# Altium project PCB_Project.PrjPcb (part 1 of 2)
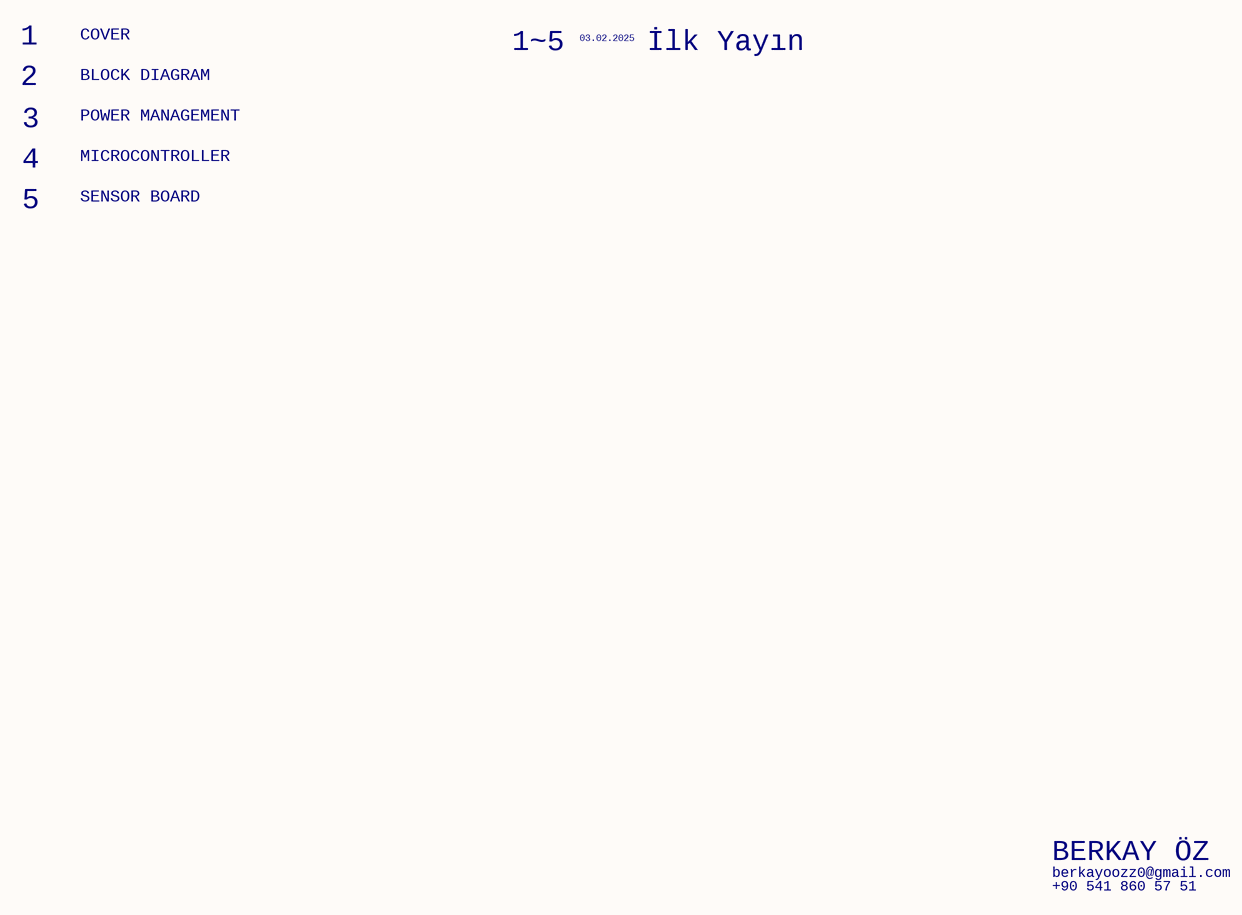
[diagram p0: Cover.SchDoc]
4 sheets, 85 parts. Net scope: flat (ports and power ports of the same name join across sheets).
Board files: PCB1.PcbDoc, PCB2_panel.PcbDoc
Sheets:
  Cover.SchDoc
  Block Diagram.SchDoc
  Microcontroller.SchDoc
  Sensorboard.SchDoc

## Sheet Cover.SchDoc
size A3; DocumentNumber: 1; SheetNumber: 1; SheetTotal: 5; PreparedBy: berkay; ReleaseDate: 23.11.2024; ENG_APP_DATE: --/--/--; DSN_APP_DATE: --/--/--; CHK_APP_DATE: --/--/--; ProjectUnit: mm

### Notes on the sheet
- 1
- COVER
- 1~5
- 03.02.2025
- İlk Yayın
- 2
- BLOCK DIAGRAM
- POWER MANAGEMENT
- 3
- 4
- MICROCONTROLLER
- 5
- SENSOR BOARD
- BERKAY ÖZ
- berkayoozz0@gmail.com
- +90 541 860 57 51
- Sayfa Nu.
- İÇİNDEKİLER / CONTENTS
- Tarih
- REVİZYON / REVISION
- ÜRETİM NOTLARI / PRODUCTION NOTES
- Page No
- Açıklama / Description
- Date
- Özellikleri
- Kart
- Features
- Board
- /
- Çıktıları
- Üretim
- Gerber
- Files
- Ekler
- Attachments
- İLETİŞİM / CONTACT
- File Name:
- Prepared:
- Size:
- Description:
- Unit:
- A3
- Released:
- Edited:
- Revision:
- Checked:
- Department:
- Approved:
- Sheet:

## Sheet Block Diagram.SchDoc
size A3; CheckedBy: deneme; DocumentNumber: 2; SheetNumber: 2; SheetTotal: 5; ProjectDescription: Wireless Security Detector; ProjectUnit: mm
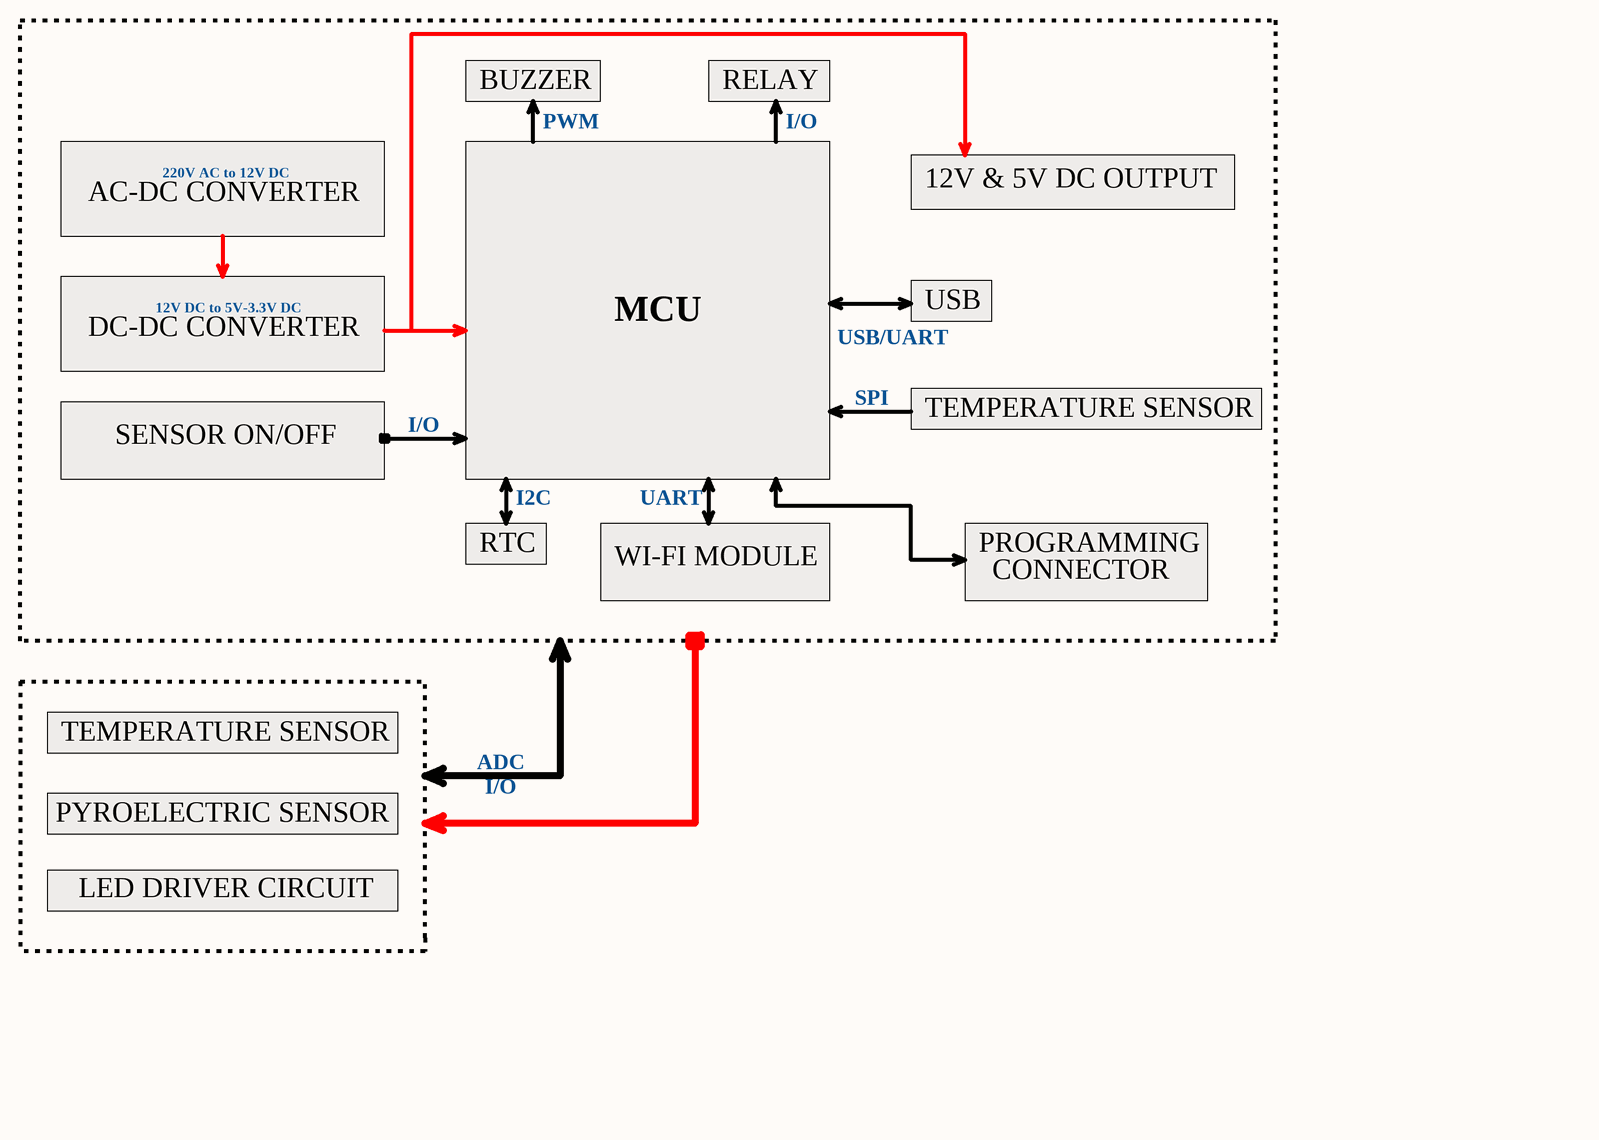
[diagram p1: Block Diagram.SchDoc]

### Notes on the sheet
- BUZZER
- PWM
- RELAY
- I/O
- AC-DC CONVERTER
- 220V AC to 12V DC
- 12V & 5V DC OUTPUT
- DC-DC CONVERTER
- 12V DC to 5V-3.3V DC
- MCU
- USB/UART
- USB
- SPI
- TEMPERATURE SENSOR
- SENSOR ON/OFF
- RTC
- I2C
- UART
- PROGRAMMING
- WI-FI MODULE
- CONNECTOR
- FUSE: 3413.0216.22
  BUCK CAPACITOR: ESH477M050AH4AA
  ZERO OHM RESISTOR: RC0603JR-070RL
  CERAMIC CAPACITORS:
  CL21A475KAQNNNE
  CL21B104KBCNNNC
  0603B103K160CT
  ALUMINUM CAPACITOR:
  EEV686M035A9HAA
  ZENER DIODE: 1SMB5919BT3G
  12V,5V DC CONNECTOR: PJ-037AH-SMT-TR
  TERMINAL BLOCK: TBP01R1-508-02BE
  PROGRAMMING CONNECTOR: SMH-105-02-L-S
  DIODE FOR RELAY: 1N4148WS
  TRANSISTOR FOR RELAY (NPN): MMBT3904-7-F
  MICRO B USB CONNECTOR:
  10118192-0001LF
  CONNECTOR: 64800611622
  CRYSTALS:
  ABS05-32.768KHZ-T
  ECS-160-20-30B-TR
  LOAD CAP FOR CRYSTALS:
  CL10C200JB8NNNC
  USB PROTECTION (TVS): USBLC6-2SC6
  IC FOR PIR SENSOR: NCS36000DRG
  RESISTORS FOR IC PIR:
  RC0603JR-07560RL
  RC0603JR-07220KL
  RC0603FR-0743KL
  CAPACITORS FOR IC PIR:
  C3216X5R1E336M160AC
  RED LED (FOR SECURITY CAM LOOK): 150080RS75000
  GREEN LED: 150080GS75000
  OPAMP: OPA314AIDBVR
- PYROELECTRIC SENSOR
- ADC
- LED DRIVER CIRCUIT
- HABERLEŞME PROTOKOLLERİ:
  UART
  USART
  I2C
  SPI
- KOMPONENTLER:
  RTC: M41T00M6F
  WIFI MODULE: ESP32-WROOM-32E-N4
  PYROSENSOR: LHI 878/3902
  TEMPERATURE OUTSIDE: TFPT1206L1002FM
  TEMPERATURE INSIDE: MAX6662MSA+
  MCU: STM32F103C6T6A
  RELAY: ALQ112
  BUZZER: CMI-9605IC-0580T
  SENSOR ON/OFF: EG1215AA
  AC-DC CONVERTER:
  TRAFO: BV302S12010-ZU
  RECTIFIER: DB105STR
  DC-DC CONVERTER:
  5V DC: LM2675MX-12/NOPB
  3.3V DC: AP7361-33E-13
  LED DRIVER MOSFET:SSM3K376R,LF
- RESISTORS:
  RC0603FR-0710KL
  RC0603JR-0715RL
  CAPACITORS:
  C0603C104K4RACTU
  ALA7DA471CF450
  PCR1E471MCL1GS
- File Name:
- Prepared:
- Size:
- Description:
- Unit:
- A3
- Released:
- Edited:
- Revision:
- Checked:
- Department:
- Approved:
- Sheet:

## Sheet Microcontroller.SchDoc
size A3; ApprovedBy: Berk AYDOĞAN; CheckedBy: KTU; DocumentNumber: 4; Revision: AA; SheetNumber: 4; SheetTotal: 5; PreparedBy: Berkay ÖZ; ProjectDescription: Wireless Security Detector; ProjectUnit: mm; ReleaseDate: 13.02.2025; Department: Department
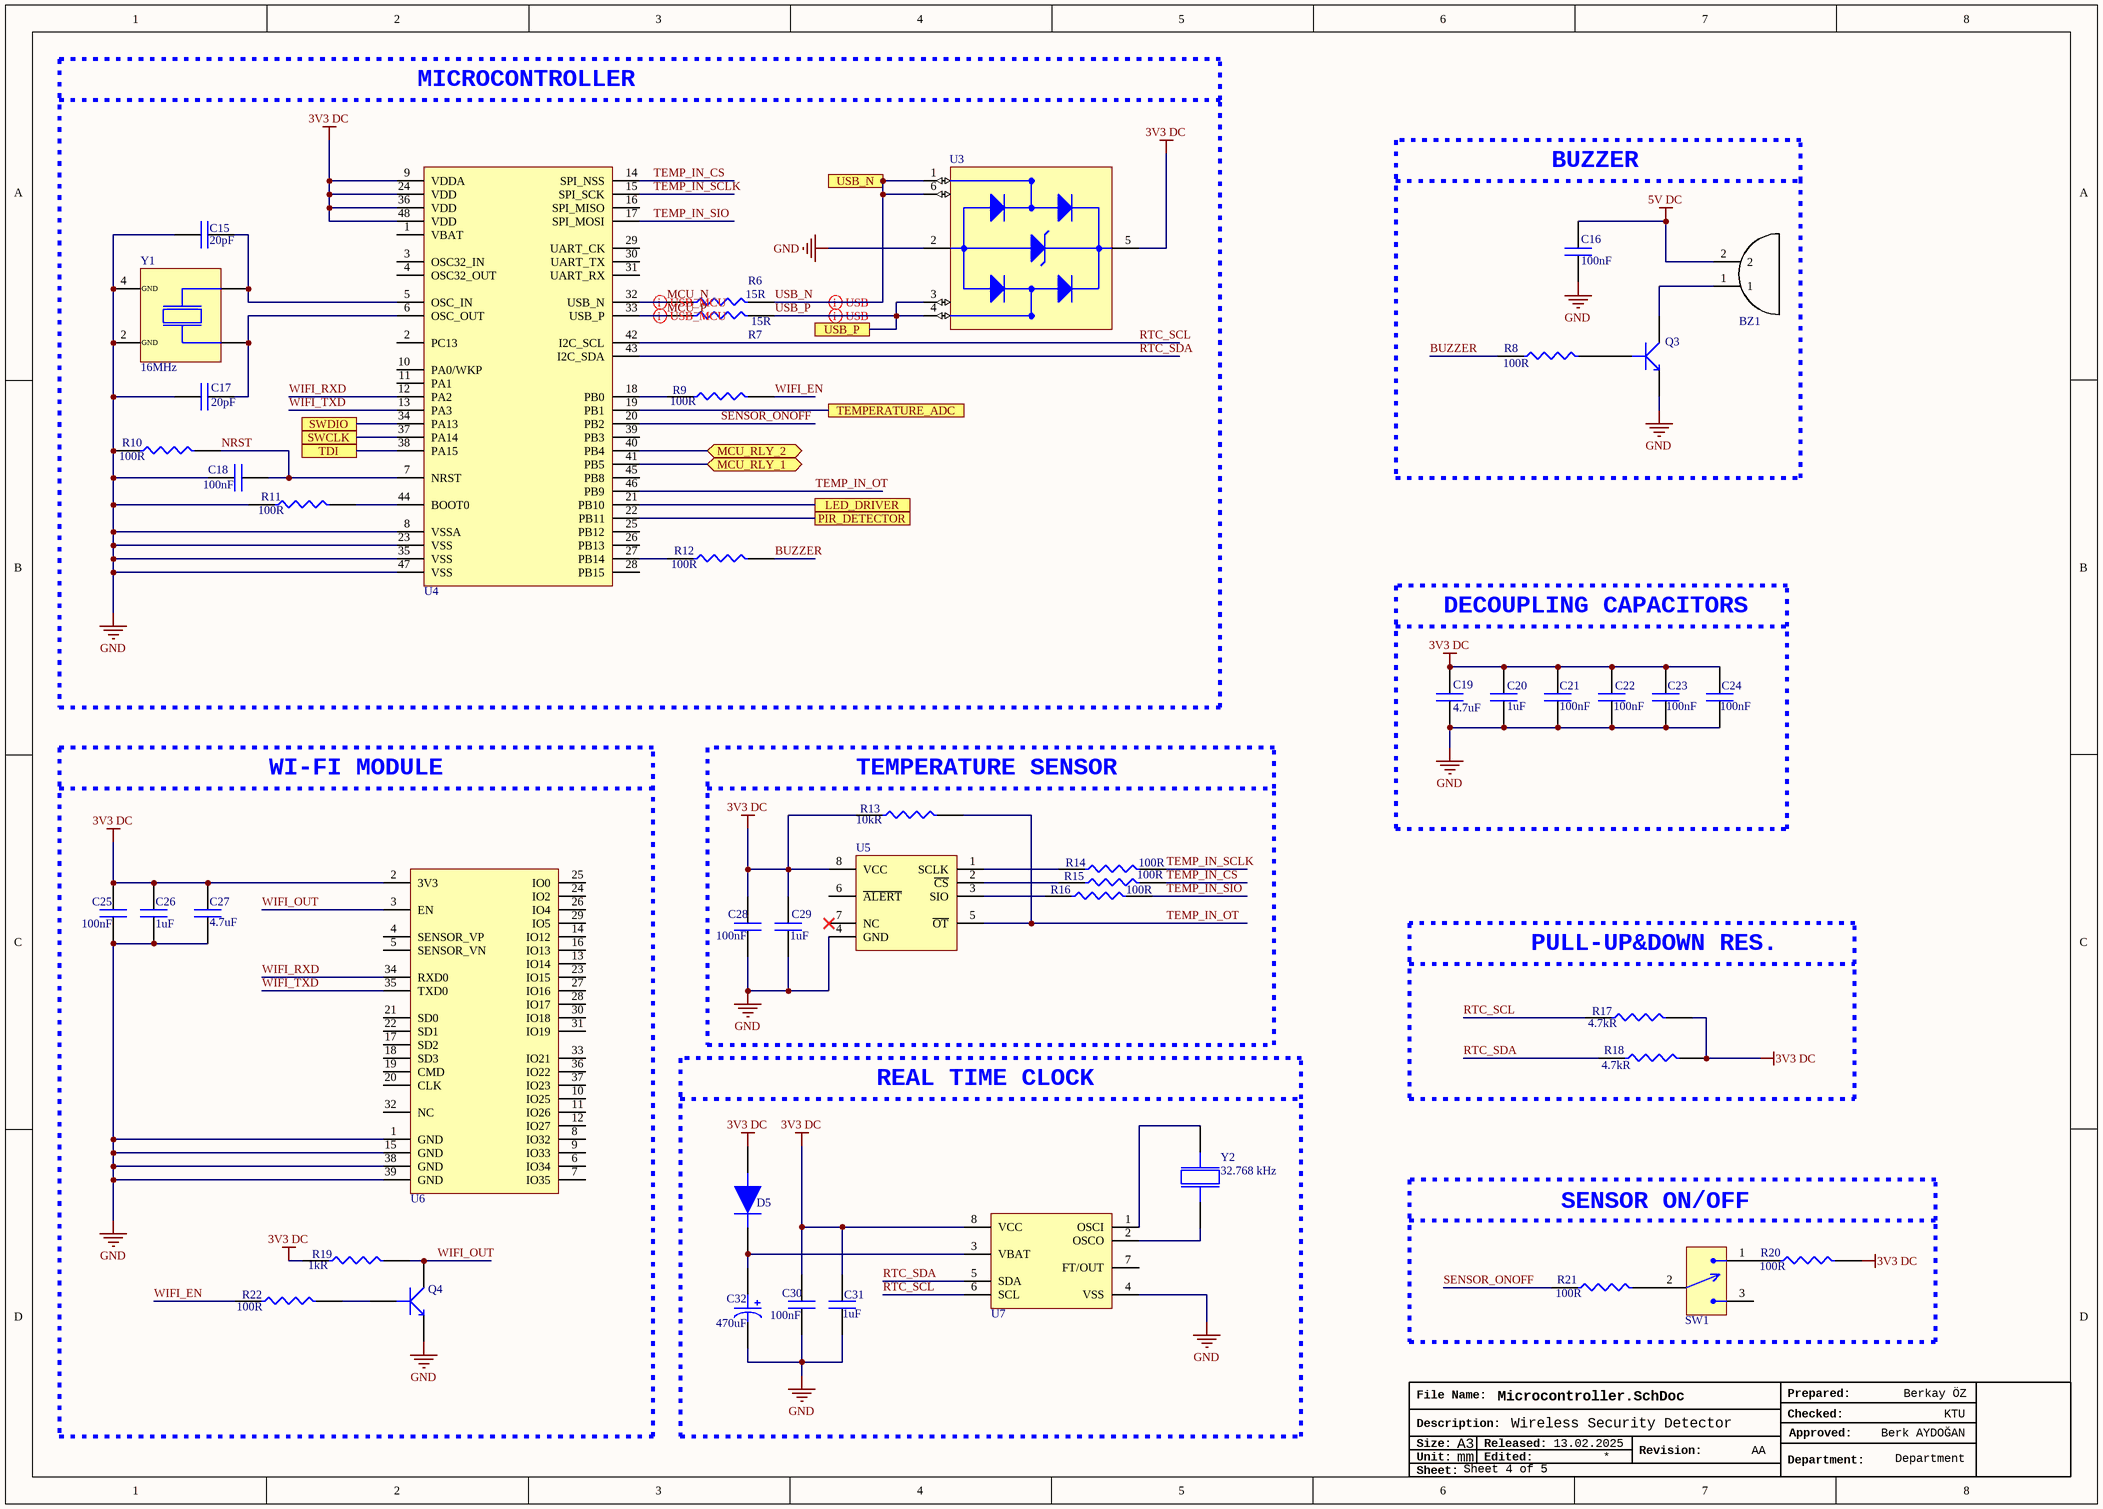
[diagram p2: Microcontroller.SchDoc]

### Parts
BZ1  CMI-9605IC-0580T  [CMI-9605IC]  (value not drawn)
C15  Capacitance: 20pF  [CAP_0603]  (hidden comment: CL10C200JB8NNNC)
C16  Capacitance: 100nF  [CAP_0805]  (hidden comment: CL21B104KBCNNNC)
C17  Capacitance: 20pF  [CAP_0603]  (hidden comment: CL10C200JB8NNNC)
C18  Capacitance: 100nF  [CAP_0805]  (hidden comment: CL21B104KBCNNNC)
C19  Capacitance: 4.7uF  [CAP_0805]  (hidden comment: CL21A475KAQNNNE)
C20  Capacitance: 1uF  [CAP_0805]  (hidden comment: CL21B105KBFNNNE)
C21  Capacitance: 100nF  [CAP_0805]  (hidden comment: CL21B104KBCNNNC)
C22  Capacitance: 100nF  [CAP_0805]  (hidden comment: CL21B104KBCNNNC)
C23  Capacitance: 100nF  [CAP_0805]  (hidden comment: CL21B104KBCNNNC)
C24  Capacitance: 100nF  [CAP_0805]  (hidden comment: CL21B104KBCNNNC)
C25  Capacitance: 100nF  [CAP_0603]  (hidden comment: C0603C104K4RACTU)
C26  Capacitance: 1uF  [CAP_0805]  (hidden comment: CL21B105KBFNNNE)
C27  Capacitance: 4.7uF  [CAP_0805]  (hidden comment: CL21A475KAQNNNE)
C28  Capacitance: 100nF  [CAP_0603]  (hidden comment: C0603C104K4RACTU)
C29  Capacitance: 1uF  [CAP_0805]  (hidden comment: CL21B105KBFNNNE)
C30  Capacitance: 100nF  [CAP_0805]  (hidden comment: CL21B104KBCNNNC)
C31  Capacitance: 1uF  [CAP_0805]  (hidden comment: CL21B105KBFNNNE)
C32  Capacitance: 470uF  [CAP_RADIAL_D10_P5]  (hidden comment: ESH477M050AH4AA)
D5  1N4148WS  [SOD323F]  (value not drawn)
Q3  MMBT3904-7-F  [SOT23F]  (value not drawn)
Q4  MMBT3904-7-F  [SOT23F]  (value not drawn)
R6  Resistance: 15R  [RES_0603]  (hidden comment: RC0603JR-0715RL)
R7  Resistance: 15R  [RES_0603]  (hidden comment: RC0603JR-0715RL)
R8  Resistance: 100R  [RES_0603]  (hidden comment: RC0603FR-07100RL)
R9  Resistance: 100R  [RES_0603]  (hidden comment: RC0603FR-07100RL)
R10  Resistance: 100R  [RES_0603]  (hidden comment: RC0603FR-07100RL)
R11  Resistance: 100R  [RES_0603]  (hidden comment: RC0603FR-07100RL)
R12  Resistance: 100R  [RES_0603]  (hidden comment: RC0603FR-07100RL)
R13  Resistance: 10kR  [RES_0603]  (hidden comment: RC0603FR-0710KL)
R14  Resistance: 100R  [RES_0603]  (hidden comment: RC0603FR-07100RL)
R15  Resistance: 100R  [RES_0603]  (hidden comment: RC0603FR-07100RL)
R16  Resistance: 100R  [RES_0603]  (hidden comment: RC0603FR-07100RL)
R17  Resistance: 4.7kR  [RES_0603]  (hidden comment: RC0603FR-074K7L)
R18  Resistance: 4.7kR  [RES_0603]  (hidden comment: RC0603FR-074K7L)
R19  Resistance: 1kR  [RES_0603]  (hidden comment: RC0603FR-071KL)
R20  Resistance: 100R  [RES_0603]  (hidden comment: RC0603FR-07100RL)
R21  Resistance: 100R  [RES_0603]  (hidden comment: RC0603FR-07100RL)
R22  Resistance: 100R  [RES_0603]  (hidden comment: RC0603FR-07100RL)
SW1  EG1215AA  [EG1215AA]  (value not drawn)
U3  USBLC6-2SC6  [SOT23-6L]  (value not drawn)
U4  STM32F103C6T6A  [LQFP-48]  (value not drawn)
U5  MAX6662  [SOIC 8]  (value not drawn)
U6  ESP32-WROOM-32  [ESP32-32]  (value not drawn)
U7  M41T00SM6F  [SOIC 8]  (value not drawn)
Y1  Frequency: 16MHz  [ECS]  (hidden comment: ECS-160-20-30B-TR)
Y2  Operating Frequency: 32.768 kHz  [ABS05]  (hidden comment: ABS05-32.768KHZ-T)

### Blocks framed on the sheet
MICROCONTROLLER: C15 C17 C18 R6 R7 R9-R12 U3 U4 Y1
WI-FI MODULE: C25-C27 Q4 R19 R22 U6

### Ports
LED_DRIVER, MCU_RLY_1 (bidir), MCU_RLY_2 (bidir), PIR_DETECTOR, SWCLK, SWDIO, TDI, TEMPERATURE_ADC, USB_N, USB_P

### Nets
3V3 DC: C19.2 C20.2 C21.2 C22.2 C23.2 C24.2 C25.2 C26.2 C27.2 C28.2 C29.2 C30.2 C31.2 D5.A R13.1 R17.2 R18.2 R19.1 R20.2 U3.5(VBUS) U4.9(VDDA) U4.24(VDD) U4.36(VDD) U4.48(VDD) U5.8(VCC) U6.2(3V3) U7.8(VCC)
5V DC: BZ1.2 C16.2
GND: C15.1 C16.1 C17.1 C18.2 C19.1 C20.1 C21.1 C22.1 C23.1 C24.1 C25.1 C26.1 C27.1 C28.1 C29.1 C30.1 C31.1 C32.2 Q3.2(E) Q4.2(E) R10.1 R11.1 U3.2(GND) U4.8(VSSA) U4.23(VSS) U4.35(VSS) U4.47(VSS) U5.4(GND) U6.1(GND) U6.15(GND) U6.38(GND) U6.39(GND) U7.4(VSS) Y1.2(GND) Y1.4(GND)
BUZZER: R8.1 R12.2
MCU_N: R6.1 U4.32(USB_N)
MCU_P: R7.1 U4.33(USB_P)
NRST: C18.1 R10.2 U4.7(NRST)
RTC_SCL: R17.1 U4.42(I2C_SCL) U7.6(SCL)
RTC_SDA: R18.1 U4.43(I2C_SDA) U7.5(SDA)
SENSOR_ONOFF: R21.1 U4.20(PB2)
TEMP_IN_CS: R15.2 U4.14(SPI_NSS)
TEMP_IN_OT: R13.2 U4.46(PB9) U5.5(~{OT})
TEMP_IN_SCLK: R14.2 U4.15(SPI_SCK)
TEMP_IN_SIO: R16.2 U4.17(SPI_MOSI)
USB_N: R6.2 U3.1(I/O1_IN) U3.6(I/O1_OUT) ; port USB_N
USB_P: R7.2 U3.3(I/O2_IN) U3.4(I/O2_OUT) ; port USB_P
WIFI_EN: R9.2 R22.1
WIFI_OUT: Q4.3(C) R19.2 U6.3(EN)
WIFI_RXD: U4.12(PA2) U6.34(RXD0)
WIFI_TXD: U4.13(PA3) U6.35(TXD0)
NetBZ1_1: BZ1.1 Q3.3(C)
NetC15_2: C15.2 U4.5(OSC_IN) Y1.3
NetC17_2: C17.2 U4.6(OSC_OUT) Y1.1
NetC32_1: C32.1 D5.C U7.3(VBAT)
NetQ3_1: Q3.1(B) R8.2
NetQ4_1: Q4.1(B) R22.2
NetR9_1: R9.1 U4.18(PB0)
NetR11_2: R11.2 U4.44(BOOT0)
NetR12_1: R12.1 U4.27(PB14)
NetR14_1: R14.1 U5.1(SCLK)
NetR15_1: R15.1 U5.2(~{CS})
NetR16_1: R16.1 U5.3(SIO)
NetR20_1: R20.1 SW1.1
NetR21_2: R21.2 SW1.2
NetU4_19: U4.19(PB1) ; port TEMPERATURE_ADC
NetU4_21: U4.21(PB10) ; port LED_DRIVER
NetU4_22: U4.22(PB11) ; port PIR_DETECTOR
NetU4_34: U4.34(PA13) ; port SWDIO
NetU4_37: U4.37(PA14) ; port SWCLK
NetU4_38: U4.38(PA15) ; port TDI
NetU4_40: U4.40(PB4) ; port MCU_RLY_2
NetU4_41: U4.41(PB5) ; port MCU_RLY_1
NetU7_1: U7.1(OSCI) Y2.2
NetU7_2: U7.2(OSCO) Y2.1

Not connected (* = marked no-connect by the designer): SW1 3; U4 1(VBAT) 2(PC13) 3(OSC32_IN) 4(OSC32_OUT) 10(PA0/WKP) 11(PA1) 16(SPI_MISO) 25(PB12) 26(PB13) 28(PB15) 29(UART_CK) 30(UART_TX) 31(UART_RX) 39(PB3) 45(PB8); U5 6(~{ALERT}) 7(NC)*; U6 4(SENSOR_VP) 5(SENSOR_VN) 6(IO34) 7(IO35) 8(IO32) 9(IO33) 10(IO25) 11(IO26) 12(IO27) 13(IO14) 14(IO12) 16(IO13) 17(SD2) 18(SD3) 19(CMD) 20(CLK) 21(SD0) 22(SD1) 23(IO15) 24(IO2) 25(IO0) 26(IO4) 27(IO16) 28(IO17) 29(IO5) 30(IO18) 31(IO19) 32(NC) 33(IO21) 36(IO22) 37(IO23); U7 7(FT/OUT)

### Layout directives
differential pair: MCU_N, MCU_P, USB_N, USB_P

### Notes on the sheet
- BUZZER
- (near C16) DECOUPLING CAPACITOR
- DECOUPLING CAPACITORS
- (near R13) TEMPERATURE SENSOR
- Datasheet'de EN bağlantısını direnç ile yapmış fakat biz bunu transistörle yapıyoruz ki kullanmak istemediğimiz durumda direnç sökmek durumunda kalmayalım ve işimizi yazılımla halledebilelim.
- PULL-UP&DOWN RES.
- MCU'ya bağlarken birisinin RX'ini diğerinin TX'ine bağlıyoruz
- REAL TIME CLOCK
- (near U7) VBAT yerine kapasitör kullanıyoruz, 470uF seviyesindeki bir kapasitör 3.3V için neredeyse pil gibi davranır.
- SENSOR ON/OFF
- (near R21) Switch'i 1 konumuna aldığımızda işlemci pinlerine 3.3V gidecek, 3 konumuna aldığımızda 0V gidecek.
- (near Q4) BJT'nin base'ine WIFI_EN üzerinden logic 1 vermek isteriz, bu nedenle WIFI_EN bir çıkıştır.
- DECOUPLING CAPACITOR
- (near R20) Sensör On Off kısmından değeri okumak istiyoruz, röleyi kontrol etmek istemiyoruz bu nedenle input
- File Name:
- Prepared:
- Size:
- Description:
- Unit:
- A3
- Released:
- Edited:
- Revision:
- Checked:
- Department:
- Approved:
- Sheet:

### Library data of the parts
BZ1 = CMI-9605IC-0580T: Buzzers Indicator, Internally Driven Magnetic 5 V 30mA 2.7kHz 80dB @ 5V, 10cm Through Hole PC Pins; Manufacturer: CUI Devices; Shape: 4456Shape; Designed by: berkay; Supplier 1: Digikey; Manufacturer Part Number: CMI-9605IC-0580T; RoHS: No; Category: Buzzers; Stock 1: 3286; Pricing 1: 1=1,14, 10=0,932, 25=0,8584, 50=0,8072, 150=0,73213, 300=0,73127 (USD); Length: 9.6mm; Width: 9.6mm; Height: 5mm; Supplier Part Number 1: 2223-CMI-9605IC-0580T-ND; Case/Package: CMI-9605IC
C15 C17 = CAP CER 20pF 0603: Ceramic Capacitor, 20pF, 50 V, 5%, Pad SMD 0603 [1608 Metric]; Manufacturer: Samsung; Designed by: berkay; Voltage Rating (DC): 50V; Supplier 1: Digikey; Manufacturer Part Number: CL10C200JB8NNNC; RoHS: Yes; Category: Ceramic Capacitors; Stock 1: 238857; Pricing 1: 1=0,1, 10=0,029, 100=0,0173, 1000=0,01144 (USD); ComponentLink1URL: https://datasheet.ciiva.com/26877/getdatasheetpartid-640634-26877974.pdf?src-supplier=Verical; ComponentLink1Description: https://datasheet.ciiva.com/26877/getdatasheetpartid-640634-26877974.pdf?src-supplier=Verical; ComponentLink2URL: https://datasheet.ciiva.com/26310/mlcc-catalogdownload2013-eng-26310315.pdf?src-supplier=Distrelec; ComponentLink2Description: https://datasheet.ciiva.com/26310/mlcc-catalogdownload2013-eng-26310315.pdf?src-supplier=Distrelec; Supplier Part Number 1: 1276-1187-1-ND; Case/Package: 0603
C16 C18 C21-C24 C30 = CAP CER 100nF 0805: Ceramic Capacitor, 0.1 uF, 50 V, ï¿½ 10%, X7R, 0805 [2012 Metric]; Manufacturer: Samsung; Designed by: berkay; Voltage Rating: 50V; Supplier 1: Digikey; Manufacturer Part Number: CL21B104KBCNNNC; RoHS: Yes; Category: Ceramic Capacitors; Stock 1: 1199576; Pricing 1: 1=0,1, 10=0,029, 100=0,0175, 1000=0,01156 (USD); Mount: Surface Mount; Case/Package: 0805; Case Code (Metric): 2012; Case Code (Imperial): 0805; Material: Ceramic; Min Operating Temperature: -55°C; Max Operating Temperature: 125°C; Tolerance: 10%; Dielectric: X7R; Packaging: Tape and Reel; Voltage: 50V; Series: CL; Construction: Flat; Voltage Rating (DC): 50V; Length: 2mm; Width: 0.049inch; Height: 0.85mm; Depth: 1.25mm; Thickness: 0.037inch; Radiation Hardening: No; RoHS Compliant: Yes; Lead Free: 5697LeadFree; ComponentLink1URL: https://datasheet.ciiva.com/25710/cl21b104kbcnnnc-25710182.pdf?src-supplier=Digikey; ComponentLink1Description: https://datasheet.ciiva.com/25710/cl21b104kbcnnnc-25710182.pdf?src-supplier=Digikey; ComponentLink2URL: https://datasheet.ciiva.com/29199/454152-da-01-en-vs-kondensator-0805-29199814.pdf?src-supplier=Conrad; ComponentLink2Description: https://datasheet.ciiva.com/29199/454152-da-01-en-vs-kondensator-0805-29199814.pdf?src-supplier=Conrad; Supplier Part Number 1: 1276-1003-1-ND
C19 C27 = CAP CER 4.7uF 0805: Ceramic Capacitor, 4.7 uF, 25 V, ± 10%, X5R, 0805 [2012 Metric]; Manufacturer: Samsung; Designed by: berkay; Voltage Rating: 25V; Supplier 1: Digikey; Manufacturer Part Number: CL21A475KAQNNNE; RoHS: Yes; Category: Ceramic Capacitors; Stock 1: 2758333; Pricing 1: 1=0,1, 10=0,048, 100=0,03, 1000=0,02035 (USD); Mount: Surface Mount; Case/Package: 0805; Case Code (Metric): 2012; Case Code (Imperial): 0805; Material: Ceramic; Min Operating Temperature: -55°C; Max Operating Temperature: 85°C; Packaging: Tape and Reel; Tolerance: 10%; Dielectric: X5R; Voltage Rating (DC): 25V; Series: CL; Construction: Flat; Length: 2mm; Height: 1.25mm; Depth: 1.25mm; Radiation Hardening: No; Lead Free: Lead Free; RoHS Compliant: Yes; ComponentLink1URL: https://datasheet.ciiva.com/25798/cl21a475kaqnnne-25798882.pdf?src-supplier=Digikey; ComponentLink1Description: https://datasheet.ciiva.com/25798/cl21a475kaqnnne-25798882.pdf?src-supplier=Digikey; Supplier Part Number 1: 1276-1244-6-ND
C20 C26 C29 C31 = CAP CER 1uF 0805: Ceramic Capacitor, 1 uF, 50 V, ï¿½ 10%, X7R, 0805 [2012 Metric]; Manufacturer: Samsung; Designed by: berkay; Voltage Rating: 50V; Supplier 1: Digikey; Manufacturer Part Number: CL21B105KBFNNNE; RoHS: Yes; Category: Ceramic Capacitors; Stock 1: 643042; Pricing 1: 1=0,1, 10=0,051, 100=0,0321, 1000=0,02181 (USD); Mount: Surface Mount; Case/Package: 0805; Case Code (Metric): 2012; Case Code (Imperial): 0805; Material: Ceramic; Min Operating Temperature: -55°C; Max Operating Temperature: 125°C; Tolerance: 10%; Packaging: Tape and Reel; Package Quantity: 1; Dielectric: X7R; Voltage: 50V; Series: CL; Construction: Flat; Voltage Rating (DC): 50V; Length: 2mm; Width: 0.049inch; Height: 1.25mm; Thickness: 0.053inch; Depth: 1.25mm; Radiation Hardening: No; RoHS Compliant: Yes; ComponentLink1URL: https://datasheet.ciiva.com/25800/cl21b105kbfnnne-25800291.pdf?src-supplier=Digikey; ComponentLink1Description: https://datasheet.ciiva.com/25800/cl21b105kbfnnne-25800291.pdf?src-supplier=Digikey; ComponentLink2URL: https://datasheet.ciiva.com/16449/cl21b105kbfnnne-16449003.pdf?src-supplier=Future+Electronics; ComponentLink2Description: https://datasheet.ciiva.com/16449/cl21b105kbfnnne-16449003.pdf?src-supplier=Future+Electronics; Supplier Part Number 1: 1276-1029-1-ND
C25 C28 = CAP CER 100nF 0603: Ceramic Capacitor, 0.1 uF, 16 V, ï¿½ 10%, X7R, 0603 [1608 Metric]; Manufacturer: KEMET; Voltage Rating: 16V; Dissipation Factor: 3.5%; Temperature Coefficient: 30ppm/°C; Designed by: berkay; Supplier 1: Digikey; Manufacturer Part Number: C0603C104K4RACTU; RoHS: Yes; Category: Ceramic Capacitors; Stock 1: 2572838; Pricing 1: 1=0,1, 10=0,042, 100=0,0259, 1000=0,01743 (USD); Mount: Surface Mount,PCB; Case/Package: 0603; Case Code (Metric): 1608; Case Code (Imperial): 0603; Weight: 7.1E-05oz; Material: Ceramic; Min Operating Temperature: -55°C; Max Operating Temperature: 125°C; Tolerance: 10%; Dielectric: X7R; Package Quantity: 4000; Packaging: Tape and Reel; Voltage Rating (DC): 16V; Termination: SMD/SMT; Voltage: 16V; Series: SMD Comm X7R; Construction: Flat; Voltage Rating (AC): 16V; Length: 1.6mm; Width: 0.8mm; Height: 0.8mm; Lead Pitch: 0.7mm; Depth: 0.8mm; Radiation Hardening: No; Reach SVHC Compliant: No; RoHS Compliant: Yes; Lead Free: Lead Free; ComponentLink1URL: https://datasheet.ciiva.com/22749/kem-c1002-x7r-smd-22749657.pdf?src-supplier=Element14; ComponentLink1Description: https://datasheet.ciiva.com/22749/kem-c1002-x7r-smd-22749657.pdf?src-supplier=Element14; ComponentLink2URL: https://datasheet.ciiva.com/14589/70095383-14589014.pdf?src-supplier=Allied+Electronics; ComponentLink2Description: https://datasheet.ciiva.com/14589/70095383-14589014.pdf?src-supplier=Allied+Electronics; ComponentLink3URL: https://datasheet.ciiva.com/5413/kem-c1002-x7r-smd-5413791.pdf?src-supplier=Mouser; ComponentLink3Description: https://datasheet.ciiva.com/5413/kem-c1002-x7r-smd-5413791.pdf?src-supplier=Mouser; ComponentLink4URL: https://datasheet.ciiva.com/18192/getdatasheetpartid-330584-18192695.pdf?src-supplier=Verical; ComponentLink4Description: https://datasheet.ciiva.com/18192/getdatasheetpartid-330584-18192695.pdf?src-supplier=Verical; Supplier Part Number 1: 399-C0603C104K4RACTUCT-ND
C32 = CAP ALU ELEC 470uF 50V: Electrolytic capacitor, 470 µF, 50 V (DC), ±20 %, radial, pitch 5 mm, Ø 13 mm; Manufacturer: KEMET; Designed by: berkay; Voltage Rating (DC): 50V; Supplier 1: Digikey; Manufacturer Part Number: ESH477M050AH4AA; RoHS: Yes; Category: LDO; Stock 1: 9368; Pricing 1: 1=0,69, 10=0,419, 50=0,3094, 200=0,2473, 600=0,21237, 1000=0,19938, 2600=0,17944, 5000=0,16849 (USD); Diameter: 10mm; Height: 20mm; ComponentLink1URL: https://api.kemet.com/component-edge/download/datasheet/ESH477M050AH4AA.pdf?src-supplier=Digikey; ComponentLink1Description: https://api.kemet.com/component-edge/download/datasheet/ESH477M050AH4AA.pdf?src-supplier=Digikey; ComponentLink2URL: https://datasheet.octopart.com/ESH477M050AH4AA-KEMET-datasheet-130075338.pdf?src-supplier=Newark; ComponentLink2Description: https://datasheet.octopart.com/ESH477M050AH4AA-KEMET-datasheet-130075338.pdf?src-supplier=Newark; Supplier Part Number 1: 399-15683-ND; Supplier 2: Newark; Stock 2: 6; Pricing 2: 1=0,51, 10=0,345, 25=0,306, 50=0,266, 100=0,227, 500=0,191, 1000=0,156 (USD); Supplier Part Number 2: 87AC7326
D5 = 1N4148WS: Diode Ultra Fast Recovery Rectifier 75V 0.15A 2-Pin SOD-323F T/R; Manufacturer: ON Semiconductor / Fairchild; Designed by: berkay; Forward Current: 150mA; Max Reverse Current: 5uA; Recovery Time: 4ns; Max Forward Surge Current (Ifsm): 2A; Element Configuration: Single; Capacitance: 4pF; Supplier 1: Digikey; Manufacturer Part Number: 1N4148WS; RoHS: Yes; Category: Rectifier Diodes; Stock 1: 336000; Pricing 1: 3000=0,03232, 6000=0,0304, 9000=0,03011 (USD); Mount: Surface Mount; Number of Pins: 2; Weight: 0.0276g; Min Operating Temperature: -55°C; Max Operating Temperature: 150°C; Packaging: Tape and Reel; Max Repetitive Reverse Voltage (Vrrm): 75V; Package Quantity: 1; Average Rectified Current: 150mA; Reverse Recovery Time: 4ns; Reverse Voltage: 75V; Max Reverse Voltage (DC): 75V; Series: -; Length: 1.8mm; Width: 1.35mm; Height: 1mm; Radiation Hardening: No; Reach SVHC Compliant: No; RoHS Compliant: Yes; Lead Free: 5697LeadFree; ComponentLink1URL: https://datasheet.ciiva.com/15208/getdatasheetpartid-127819-15208358.pdf?src-supplier=Verical; ComponentLink1Description: https://datasheet.ciiva.com/15208/getdatasheetpartid-127819-15208358.pdf?src-supplier=Verical; Supplier Part Number 1: 1N4148WSFSTR-ND
Q3 Q4 = MMBT3904-7-F: Transistor General Purpose BJT NPN 40 Volt 0.2A Automotive 3-Pin SOT-23; Manufacturer: Diodes Zetex; Designed by: berkay; Max Power Dissipation: 300mW; Collector Emitter Voltage (VCEO): 40V; Max Collector Current: 200mA; Collector Base Voltage (VCBO): 60V; Frequency: 300MHz; hFE Min: 100; Number of Elements: 1; Emitter Base Voltage (VEBO): 6V; Collector Emitter Saturation Voltage: 300mV; Power Dissipation: 350mW; Supplier 1: Digikey; Manufacturer Part Number: MMBT3904-7-F; RoHS: Yes; Category: BJTs; Stock 1: 3637798; Pricing 1: 3000=0,02356, 6000=0,02087, 9000=0,01949, 15000=0,01794, 21000=0,01702, 30000=0,01613, 75000=0,01416, 150000=0,01294, 300000=0,01192 (USD); Mount: Surface Mount; Case/Package: SOT-23; Number of Pins: 3; Weight: 0.000282oz; Min Operating Temperature: -55°C; Max Operating Temperature: 150°C; Polarity: NPN; Packaging: Tape and Reel; Package Quantity: 3000; Transition Frequency: 300MHz; Collector Emitter Breakdown Voltage: 40V; Max Breakdown Voltage: 40V; Continuous Collector Current: 200mA; Max Frequency: 300MHz; Gain Bandwidth Product: 300MHz; Voltage Rating (DC): 40V; Series: Automotive, AEC-Q101; Collector-emitter Voltage-Max: 300mV; Length: 3.05mm; Width: 1.4mm; Height: 1mm; Radiation Hardening: No; Reach SVHC Compliant: No; Lead Free: Lead Free; RoHS Compliant: Yes; ComponentLink1URL: https://datasheet.ciiva.com/11201/ds30036-11201778.pdf?src-supplier=Avnet; ComponentLink1Description: https://datasheet.ciiva.com/11201/ds30036-11201778.pdf?src-supplier=Avnet; ComponentLink2URL: https://datasheet.ciiva.com/15138/getdatasheetpartid-53265-15138780.pdf?src-supplier=Verical; ComponentLink2Description: https://datasheet.ciiva.com/15138/getdatasheetpartid-53265-15138780.pdf?src-supplier=Verical; ComponentLink3URL: https://datasheet.ciiva.com/22711/1915516-22711750.pdf?src-supplier=Element14; ComponentLink3Description: https://datasheet.ciiva.com/22711/1915516-22711750.pdf?src-supplier=Element14; ComponentLink4URL: https://datasheet.ciiva.com/11198/ds30036-11198999.pdf?src-supplier=Avnet; ComponentLink4Description: https://datasheet.ciiva.com/11198/ds30036-11198999.pdf?src-supplier=Avnet; ComponentLink5URL: https://datasheet.ciiva.com/6361/ds30036-6361256.pdf?src-supplier=Digikey; ComponentLink5Description: https://datasheet.ciiva.com/6361/ds30036-6361256.pdf?src-supplier=Digikey; ComponentLink6URL: https://datasheet.ciiva.com/6361/ds30036-6361254.pdf?src-supplier=Digikey; ComponentLink6Description: https://datasheet.ciiva.com/6361/ds30036-6361254.pdf?src-supplier=Digikey; Supplier Part Number 1: MMBT3904-FDITR-ND
R6 R7 = RES 15 OHM 0603: SMD Chip Resistor, 15 Ohm, ï¿½ 5%, 100 mW, 0603 [1608 Metric], Thick Film, General Purpose; Manufacturer: Yageo; Designed by: berkay; Voltage Rating (AC): 50V; Supplier 1: Digikey; Manufacturer Part Number: RC0603JR-0715RL; RoHS: Yes; Category: Chip SMD Resistors; Stock 1: 90104; Pricing 1: 1=0,1, 10=0,008, 50=0,0072, 100=0,0061, 500=0,0051, 1000=0,00408 (USD); Lead Free: 5697LeadFree; ComponentLink1URL: https://datasheet.ciiva.com/2453/pyu-r-int-thick-7-2453085.pdf?src-supplier=Digikey; ComponentLink1Description: https://datasheet.ciiva.com/2453/pyu-r-int-thick-7-2453085.pdf?src-supplier=Digikey; ComponentLink2URL: https://datasheet.ciiva.com/2453/pyu-r-int-thick-7-2453086.pdf?src-supplier=Digikey; ComponentLink2Description: https://datasheet.ciiva.com/2453/pyu-r-int-thick-7-2453086.pdf?src-supplier=Digikey; ComponentLink3URL: https://datasheet.ciiva.com/2453/pyu-r-int-thick-7-2453087.pdf?src-supplier=Digikey; ComponentLink3Description: https://datasheet.ciiva.com/2453/pyu-r-int-thick-7-2453087.pdf?src-supplier=Digikey; ComponentLink4URL: https://datasheet.ciiva.com/7746/443971-7746445.pdf?src-supplier=Element14; ComponentLink4Description: https://datasheet.ciiva.com/7746/443971-7746445.pdf?src-supplier=Element14; ComponentLink5URL: https://datasheet.ciiva.com/7746/443971-7746446.pdf?src-supplier=Element14; ComponentLink5Description: https://datasheet.ciiva.com/7746/443971-7746446.pdf?src-supplier=Element14; Supplier Part Number 1: 311-15GRCT-ND; Case/Package: 0603
R8-R12 R14-R16 R20-R22 = RES 100 OHM 0603: SMD Chip Resistor, 100 Ohm, ï¿½ 1%, 100 mW, 0603 [1608 Metric], Thick Film, General Purpose; Manufacturer: Yageo; Designed by: berkay; Temperature Coefficient: 100ppm/°C; Voltage Rating (DC): 50V; Power Rating: 100mW; Supplier 1: Future Electronics; Manufacturer Part Number: RC0603FR-07100RL; RoHS: Yes; Category: Chip SMD Resistors; Stock 1: 7550000; Pricing 1: 5000=0,0011, 25000=0,0011, 125000=0,001, 250000=0,001, 750000=0,001 (USD); Case/Package: 0603; Number of Pins: 2; Case Code (Imperial): 0603; Case Code (Metric): 1608; Size Code: 0603; Min Operating Temperature: -55°C; Max Operating Temperature: 155°C; Tolerance: 1%; Resistor Type: Thick Film; Packaging: Tape and Reel; Voltage Rating: 50V; Termination: SMD/SMT; Features: Moisture Resistant; Series: RC; Max Power Dissipation: 100mW; Number of Terminations: 2; Construction: Rectangular; Resistance Tolerance: 1%; Technology: THICK FILM; Length: 1.6mm; Width: 0.8mm; Height: 0.45mm; Depth: 0.8mm; Lead Free: Lead Free; Reach SVHC Compliant: Unknown; RoHS Compliant: Yes; Military Standard: Not; Supplier Part Number 1: 7334493
R13 = RES 10K OHM 0603: SMD Chip Resistor, 10 kOhm, ï¿½ 1%, 100 mW, 0603 [1608 Metric], Thick Film, General Purpose; Manufacturer: Yageo; Temperature Coefficient: 100ppm/°C; Voltage Rating (DC): 50V; Voltage Rating: 75V; Power Rating: 100mW; Designed by: berkay; Supplier 1: Digikey; Manufacturer Part Number: RC0603FR-0710KL; RoHS: Yes; Category: Chip SMD Resistors; Stock 1: 4933566; Pricing 1: 1=0,1, 10=0,009, 100=0,0082, 1000=0,00714, 2500=0,00663 (USD); Case/Package: 0603; Number of Pins: 2; Case Code (Imperial): 0603; Case Code (Metric): 1608; Weight: 7.1E-05oz; Size Code: 0603; Min Operating Temperature: -55°C; Max Operating Temperature: 155°C; Tolerance: 1%; Resistor Type: Thick Film; Packaging: Tape and Reel; Termination: SMD/SMT; Features: Moisture Resistant; Series: RC; Max Power Dissipation: 100mW; Number of Terminations: 2; Resistance Tolerance: 1%; Construction: Rectangular; Length: 1.6mm; Width: 0.8mm; Height: 0.45mm; Depth: 0.8mm; Lead Pitch: 0.3mm; Reach SVHC Compliant: No; Lead Free: 5697LeadFree; RoHS Compliant: Yes; Military Standard: Not; ComponentLink1URL: https://datasheet.ciiva.com/7660/38590-7660789.pdf?src-supplier=Element14; ComponentLink1Description: https://datasheet.ciiva.com/7660/38590-7660789.pdf?src-supplier=Element14; ComponentLink2URL: https://datasheet.ciiva.com/7983/443971-7983596.pdf?src-supplier=Element14; ComponentLink2Description: https://datasheet.ciiva.com/7983/443971-7983596.pdf?src-supplier=Element14; ComponentLink3URL: https://datasheet.ciiva.com/22747/443971-22747519.pdf?src-supplier=Element14; ComponentLink3Description: https://datasheet.ciiva.com/22747/443971-22747519.pdf?src-supplier=Element14; ComponentLink4URL: https://datasheet.ciiva.com/46440/1868787-46440891.pdf?src-supplier=Element14; ComponentLink4Description: https://datasheet.ciiva.com/46440/1868787-46440891.pdf?src-supplier=Element14; ComponentLink5URL: https://datasheet.ciiva.com/7746/1738695-7746239.pdf?src-supplier=Element14; ComponentLink5Description: https://datasheet.ciiva.com/7746/1738695-7746239.pdf?src-supplier=Element14; ComponentLink6URL: https://datasheet.ciiva.com/15189/getdatasheetpartid-409289-15189591.pdf?src-supplier=Verical; ComponentLink6Description: https://datasheet.ciiva.com/15189/getdatasheetpartid-409289-15189591.pdf?src-supplier=Verical; Supplier Part Number 1: 311-10.0KHRCT-ND
R17 R18 = RES 4K7 OHM 0603: SMD Chip Resistor, 4.7 kOhm, ï¿½ 1%, 100 mW, 0603 [1608 Metric], Thick Film, General Purpose; Manufacturer: Yageo; Designed by: berkay; Power Rating: 100mW; Voltage Rating (DC): 50V; Temperature Coefficient: 100ppm/°C; Supplier 1: Future Electronics; Manufacturer Part Number: RC0603FR-074K7L; RoHS: Yes; Category: Chip SMD Resistors; Stock 1: 12255000; Pricing 1: 5000=0,0011, 20000=0,001, 75000=0,001, 150000=0,0009, 375000=0,0009 (USD); Case/Package: 0603; Number of Pins: 2; Case Code (Imperial): 0603; Case Code (Metric): 1608; Size Code: 0603; Min Operating Temperature: -55°C; Max Operating Temperature: 155°C; Tolerance: 1%; Resistor Type: Thick Film; Packaging: Tape and Reel; Voltage Rating: 50V; Termination: SMD/SMT; Features: Moisture Resistant; Series: RC; Max Power Dissipation: 100mW; Number of Terminations: 2; Construction: Rectangular; Resistance Tolerance: 1%; Length: 1.6mm; Width: 0.8mm; Depth: 0.8mm; Lead Pitch: 0.3mm; RoHS Compliant: Yes; Reach SVHC Compliant: Unknown; Lead Free: 5697LeadFree; Military Standard: Not; ComponentLink1URL: https://datasheet.ciiva.com/15189/getdatasheetpartid-422754-15189760.pdf?src-supplier=Verical; ComponentLink1Description: https://datasheet.ciiva.com/15189/getdatasheetpartid-422754-15189760.pdf?src-supplier=Verical; ComponentLink2URL: https://datasheet.ciiva.com/7660/38590-7660794.pdf?src-supplier=Element14; ComponentLink2Description: https://datasheet.ciiva.com/7660/38590-7660794.pdf?src-supplier=Element14; ComponentLink3URL: https://datasheet.ciiva.com/22747/443971-22747528.pdf?src-supplier=Element14; ComponentLink3Description: https://datasheet.ciiva.com/22747/443971-22747528.pdf?src-supplier=Element14; ComponentLink4URL: https://datasheet.ciiva.com/7746/1868787-7746365.pdf?src-supplier=Element14; ComponentLink4Description: https://datasheet.ciiva.com/7746/1868787-7746365.pdf?src-supplier=Element14; ComponentLink5URL: https://datasheet.ciiva.com/7746/1738695-7746366.pdf?src-supplier=Element14; ComponentLink5Description: https://datasheet.ciiva.com/7746/1738695-7746366.pdf?src-supplier=Element14; ComponentLink6URL: https://datasheet.ciiva.com/46440/1868787-46440909.pdf?src-supplier=Element14; ComponentLink6Description: https://datasheet.ciiva.com/46440/1868787-46440909.pdf?src-supplier=Element14; Supplier Part Number 1: 5489695
R19 = RES 1K OHM 0603: SMD Chip Resistor, 1 kOhm, ï¿½ 1%, 100 mW, 0603 [1608 Metric], Thick Film, General Purpose; Manufacturer: Yageo; Designed by: berkay; Temperature Coefficient: 100ppm/°C; Power Rating: 100mW; Voltage Rating: 50V; Supplier 1: Future Electronics; Manufacturer Part Number: RC0603FR-071KL; RoHS: Yes; Category: Chip SMD Resistors; Stock 1: 27410000; Pricing 1: 5000=0,0011, 25000=0,0011, 125000=0,001, 250000=0,001, 750000=0,001 (USD); Case/Package: 0603; Contact Plating: Tin,Matte; Case Code (Imperial): 0603; Case Code (Metric): 1608; Size Code: 0603; Min Operating Temperature: -55°C; Max Operating Temperature: 155°C; Tolerance: 1%; Resistor Type: Thick Film; Packaging: Tape and Reel; Termination: SMD/SMT; Features: Moisture Resistant; Series: RC; Max Power Dissipation: 100mW; Number of Terminations: 2; Technology: THICK FILM; Resistance Tolerance: 1%; Construction: Rectangular; Length: 1.6mm; Height: 0.45mm; Depth: 0.8mm; Reach SVHC Compliant: No; Lead Free: 5697LeadFree; Military Standard: Not; RoHS Compliant: Yes; Supplier Part Number 1: 4016291
SW1 = EG1215AA: Slide Switch, SPDT, ON-ON, 25 mA, 24V DC, Surf. Mt., RA, Gull Wing | E-Switch EG1215AA; Mechanical Life: 10000Cycles; Actuator Type: Standard; Switch Travel: 1.5mm; Operating Force: 150gf; Contact Current Rating: 25mA; Number of Positions: 2NUMBER; Actuator Length: 1.4mm; Designed by: berkay; Supplier 1: Digikey; Manufacturer: E-Switch; Manufacturer Part Number: EG1215AA; RoHS: Yes; Category: LDO; Stock 1: 611; Pricing 1: 1=1,18, 10=0,963, 25=0,8868, 100=0,7809, 250=0,71708, 500=0,67178, 1000=0,62888 (USD); Mount: Surface Mount; Contact Material: 151ConductorMaterial; Min Operating Temperature: -20°C; Max Operating Temperature: 70°C; Throw Configuration: SPDT; Packaging: Cut Tape; Switch Function: On-On; Voltage Rating (DC): 24V; Termination: Gull Wing; Electrical Life: 10000Cycles; Series: EG; RoHS Compliant: Yes; ComponentLink1URL: https://media.digikey.com/pdf/Data%20Sheets/E-Switch%20PDFs/EG1215_Series_Ds.pdf?src-supplier=Digikey; ComponentLink1Description: https://media.digikey.com/pdf/Data%20Sheets/E-Switch%20PDFs/EG1215_Series_Ds.pdf?src-supplier=Digikey; ComponentLink2URL: http://www.farnell.com/datasheets/2645007.pdf?src-supplier=Farnell; ComponentLink2Description: http://www.farnell.com/datasheets/2645007.pdf?src-supplier=Farnell; Supplier Part Number 1: EG5720CT-ND
U3 = USB PROTECTION: ESD Suppressor Diode Array Dual Uni-Dir 15kV Air Gap/15kV Contact Disc 6-Pin SOT-23 T/R; Manufacturer: STMicroelectronics; Designed by: berkay; Direction: Unidirectional,Bidirectional; Capacitance: 3.5pF; Operating Supply Voltage: 1.1V; Number of Channels: 2; Breakdown Voltage: 6V; Clamping Voltage: 17V; Reverse Standoff Voltage: 5.25V; Power Line Protection: Yes; Test Current: 1mA; Max Reverse Leakage Current: 150nA; Peak Pulse Current: 5A; Data Rate: 480Mbps; Number of Elements: 1; Working Voltage: 5V; Supplier 1: Digikey; Manufacturer Part Number: USBLC6-2SC6; RoHS: Yes; Category: TVS Diodes; Stock 1: 60858; Pricing 1: 1=0,36, 10=0,243, 100=0,163, 500=0,127, 1000=0,114 (USD); Mount: Surface Mount; Case/Package: SOT-23; Number of Pins: 6; Min Operating Temperature: -40°C; Max Operating Temperature: 125°C; Packaging: Tape and Reel; Package Quantity: 3000; Termination: SMD/SMT; Number of Bidirectional Channels: 2; Min Breakdown Voltage: 6V; ESD Protection: Yes; Leakage Current: 150nA; Series: USB; Reverse Breakdown Voltage: 6V; Polarity: Unidirectional,Bidirectional; Max Breakdown Voltage: 6V; Clamping Voltage-Max: 17V; Max Repetitive Reverse Voltage (Vrrm): 5.25V; Length: 3.05mm; Width: 1.75mm; Height: 1.3mm; Depth: 1.75mm; Radiation Hardening: No; Lead Free: Lead Free; Reach SVHC Compliant: No; RoHS Compliant: Yes; ComponentLink1URL: https://datasheet.ciiva.com/1268/1690354-1268384.pdf?src-supplier=Element14; ComponentLink1Description: https://datasheet.ciiva.com/1268/1690354-1268384.pdf?src-supplier=Element14; ComponentLink2URL: https://datasheet.ciiva.com/4508/cd00050750-113117-4508433.pdf?src-supplier=Mouser; ComponentLink2Description: https://datasheet.ciiva.com/4508/cd00050750-113117-4508433.pdf?src-supplier=Mouser; ComponentLink3URL: https://datasheet.ciiva.com/15143/getdatasheetpartid-148465-15143789.pdf?src-supplier=Verical; ComponentLink3Description: https://datasheet.ciiva.com/15143/getdatasheetpartid-148465-15143789.pdf?src-supplier=Verical; ComponentLink4URL: https://datasheet.ciiva.com/16200/cd00050750-16200026.pdf?src-supplier=Future+Electronics; ComponentLink4Description: https://datasheet.ciiva.com/16200/cd00050750-16200026.pdf?src-supplier=Future+Electronics; ComponentLink5URL: https://datasheet.ciiva.com/41444/001184109-da-01-en-ic-esd-protecti-usblc6-2sc6-sot-23-6-stm-41444156.pdf?src-supplier=Conrad; ComponentLink5Description: https://datasheet.ciiva.com/41444/001184109-da-01-en-ic-esd-protecti-usblc6-2sc6-sot-23-6-stm-41444156.pdf?src-supplier=Conrad; Supplier Part Number 1: 497-5235-1-ND
U4 = STM32F103C6T6A: MCU 32-bit STM32F ARM Cortex M3 RISC 32KB Flash 2.5V/3.3V 48-Pin LQFP Tray; Manufacturer: STMicroelectronics; Number of Timers/Counters: 3; Max Supply Voltage: 3.6V; Interface: I2C,SPI,USART; RAM Size: 10KB; Number of I/Os: 37; Min Supply Voltage: 2V; Data Bus Width: 32b; Max Frequency: 72MHz; Number of ADC Channels: 10; Designed by: Berkay; Supplier 1: Digikey; Manufacturer Part Number: STM32F103C6T6A; RoHS: Yes; Category: Microcontrollers; Stock 1: 663; Pricing 1: 1=5,48, 10=4,191, 25=3,8684, 80=3,5615, 250=3,34396, 500=3,2419, 1000=3,15789, 2500=3,06924 (USD); Case/Package: LQFP; Number of Pins: 48; Weight: 0.006409oz; Min Operating Temperature: -40°C; Max Operating Temperature: 85°C; Packaging: Tray; Series: STM32F103C6; Package Quantity: 1500; Memory Type: FLASH; Memory Size: 32KB; Core Architecture: ARM; Length: 7mm; Width: 7mm; Height: 1.4mm; Lead Free: Lead Free; RoHS Compliant: Yes; ComponentLink1URL: https://datasheet.ciiva.com/15122/getdatasheetpartid-69879-15122075.pdf?src-supplier=Verical; ComponentLink1Description: https://datasheet.ciiva.com/15122/getdatasheetpartid-69879-15122075.pdf?src-supplier=Verical; ComponentLink2URL: https://datasheet.ciiva.com/14100/pustm-arm-microcont-stm32f103-en-14100507.pdf?src-supplier=Distrelec; ComponentLink2Description: https://datasheet.ciiva.com/14100/pustm-arm-microcont-stm32f103-en-14100507.pdf?src-supplier=Distrelec; Stock 2: 1960; Pricing 2: 1=6,02, 10=4,74, 25=4,11, 50=4,04, 100=3,96 (USD); Supplier 2: Avnet; Supplier Part Number 1: 497-11515-ND; Supplier Part Number 2: 72T2643
U5 = MAX6662MSA+: Temp Sensor Digital Serial (3-Wire, SPI) 8-Pin SOIC N Tube; Manufacturer: Maxim; Designed by: berkay; Supplier 1: Digikey; Manufacturer Part Number: MAX6662MSA+; RoHS: Yes; Category: Temperature and Humidity Sensors; Stock 1: 320; Pricing 1: 1=4,11, 5=3,576, 10=3,387, 25=3,1672, 50=3,0212, 100=2,8904, 500=2,63676, 1000=2,54588 (USD); ComponentLink1URL: https://datasheet.ciiva.com/5299/max6662-89142-5299456.pdf?src-supplier=Mouser; ComponentLink1Description: https://datasheet.ciiva.com/5299/max6662-89142-5299456.pdf?src-supplier=Mouser; ComponentLink2URL: https://datasheet.ciiva.com/3277/max6662-3277979.pdf?src-supplier=Avnet; ComponentLink2Description: https://datasheet.ciiva.com/3277/max6662-3277979.pdf?src-supplier=Avnet; ComponentLink3URL: https://datasheet.ciiva.com/2003/max6662-2003390.pdf?src-supplier=Digikey; ComponentLink3Description: https://datasheet.ciiva.com/2003/max6662-2003390.pdf?src-supplier=Digikey; Supplier Part Number 1: MAX6662MSA+-ND; Case/Package: SOIC-8
U6 = ESP32-WROOM-32: SMD MODULE, ESP32-D0WDQ6, 32MBIT; Manufacturer: Espressif Systems; Designed by: berkay; Supply Voltage-Nom: 3V3; Frequency: 2.5GHz; Data Rate: 150Mbps; Sensitivity: -98dBm; Operating Supply Voltage: 3.6V; RoHS: No; Max Operating Temperature: +85; Min Operating Temperature: -40; Supplier 1: Digi-Key; Manufacturer Part Number: ESP32-WROOM-32; Category: RF Receivers, Transceivers; Pricing 1: 1=3,80000 (USD); Mount: Surface Mount; Case/Package: SMD/SMT; Weight: 0.088185oz; Packaging: Cut Tape; Package Quantity: 550; ComponentLink1URL: https://datasheet.ciiva.com/70828/esp32-wroom-32-datasheet-en-70828769.pdf?src-supplier=Digi-Key; ComponentLink1Description: https://datasheet.ciiva.com/70828/esp32-wroom-32-datasheet-en-70828769.pdf?src-supplier=Digi-Key; ComponentLink2URL: https://datasheet.ciiva.com/69725/esp32-datasheet-en-69725253.pdf?src-supplier=Digi-Key; ComponentLink2Description: https://datasheet.ciiva.com/69725/esp32-datasheet-en-69725253.pdf?src-supplier=Digi-Key; Supplier Part Number 1: 1904-1010-1-ND
U7 = M41T00SM6F: M41T00S Series 5.5 V I2C / 2-Wire / Serial SMT Real Time Clock - SOIC-8; Manufacturer: STMicroelectronics; Designed by: berkay; Supplier 1: Digikey; Manufacturer Part Number: M41T00SM6F; RoHS: Yes; Category: Real Time Clocks; Stock 1: 2221; Pricing 1: 1=3,32, 10=2,495, 25=2,288, 100=2,0608, 250=1,9524, 500=1,88706, 1000=1,83327 (USD); ComponentLink1URL: https://datasheet.ciiva.com/16219/cd00043079-16219612.pdf?src-supplier=Future+Electronics; ComponentLink1Description: https://datasheet.ciiva.com/16219/cd00043079-16219612.pdf?src-supplier=Future+Electronics; ComponentLink2URL: https://datasheet.ciiva.com/4772/cd00043079-112038-4772343.pdf?src-supplier=Mouser; ComponentLink2Description: https://datasheet.ciiva.com/4772/cd00043079-112038-4772343.pdf?src-supplier=Mouser; Supplier Part Number 1: 497-6458-1-ND; Case/Package: SOIC-8
Y1 = CRYSTAL 16MHz: Crystal 16MHz ±30ppm (Tol) ±50ppm (Stability) 20pF FUND 50Ohm 4-Pin Mini-SMD T/R; Manufacturer: ECS International; Designed by: berkay; Supplier 1: Digikey; Manufacturer Part Number: ECS-160-20-30B-TR; RoHS: Yes; Category: Crystals; Stock 1: 14914; Pricing 1: 1=0,66, 10=0,58, 50=0,5182, 100=0,4968, 500=0,4504 (USD); ComponentLink1URL: https://datasheet.ciiva.com/853/ecx-53b-853408.pdf?src-supplier=Digikey; ComponentLink1Description: https://datasheet.ciiva.com/853/ecx-53b-853408.pdf?src-supplier=Digikey; ComponentLink2URL: https://datasheet.ciiva.com/853/ecx-53b-853407.pdf?src-supplier=Digikey; ComponentLink2Description: https://datasheet.ciiva.com/853/ecx-53b-853407.pdf?src-supplier=Digikey; ComponentLink3URL: https://datasheet.ciiva.com/853/ecx-53b-853406.pdf?src-supplier=Digikey; ComponentLink3Description: https://datasheet.ciiva.com/853/ecx-53b-853406.pdf?src-supplier=Digikey; Supplier Part Number 1: XC1120CT-ND
Y2 = CRYSTAL 32.768kHz: Crystal 0.032768MHz ±20ppm (Tol) 12.5pF Flexural 90000Ohm 2-Pin CSMD T/R; Manufacturer: Abracon; Designed by: berkay; ESR (Equivalent Series Resistance): 90kR; Supplier 1: Digikey; Manufacturer Part Number: ABS05-32.768KHZ-T; RoHS: Yes; Category: Crystals; Stock 1: 96000; Pricing 1: 3000=0,40284, 6000=0,34349, 9000=0,33772, 15000=0,33643, 21000=0,33565 (USD); Mount: Surface Mount; Case/Package: CSMD; Number of Pins: 2; Min Operating Temperature: -40°C; Max Operating Temperature: 85°C; Packaging: Tape and Reel; Frequency Tolerance: 20ppm; Load Capacitance: 12.5pF; Package Quantity: 3000; Frequency: 32.768kHz; Tolerance: 20ppm; Termination: SMD/SMT; Series Resistance: 90kR; Series: ABS05; Length: 1.6mm; Width: 1mm; Height: 0.5mm; Depth: 1mm; Radiation Hardening: No; Reach SVHC Compliant: No; Lead Free: Lead Free; RoHS Compliant: Yes; ComponentLink1URL: https://datasheet.ciiva.com/23810/abs05-23810480.pdf?src-supplier=Newark; ComponentLink1Description: https://datasheet.ciiva.com/23810/abs05-23810480.pdf?src-supplier=Newark; ComponentLink2URL: https://datasheet.ciiva.com/6728/abs05-6728949.pdf?src-supplier=Digikey; ComponentLink2Description: https://datasheet.ciiva.com/6728/abs05-6728949.pdf?src-supplier=Digikey; ComponentLink3URL: https://datasheet.ciiva.com/6728/abs05-6728950.pdf?src-supplier=Digikey; ComponentLink3Description: https://datasheet.ciiva.com/6728/abs05-6728950.pdf?src-supplier=Digikey; ComponentLink4URL: https://datasheet.ciiva.com/16411/abs05-16411149.pdf?src-supplier=Future+Electronics; ComponentLink4Description: https://datasheet.ciiva.com/16411/abs05-16411149.pdf?src-supplier=Future+Electronics; Supplier Part Number 1: 535-11899-2-ND